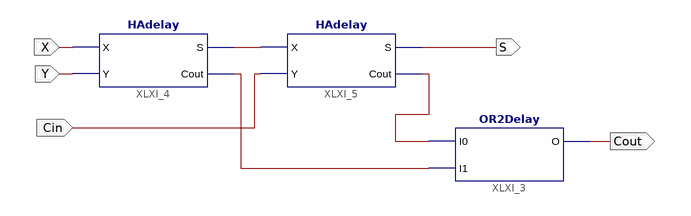
[diagram p0: schematic sheet 1]
// Xilinx ISE schematic FAdelay.sch (spartan6) as structural Verilog: 3 symbols, 5 ports
module FAdelay (
  input  Cin,
  input  X,
  input  Y,
  output S,
  output Cout
);

  wire XLXN_1, XLXN_3, XLXN_4;

  OR2Delay XLXI_3 (.I0(XLXN_4), .I1(XLXN_3), .O(Cout));
  HAdelay XLXI_4 (.X(X), .Y(Y), .S(XLXN_1), .Cout(XLXN_3));
  HAdelay XLXI_5 (.X(XLXN_1), .Y(Cin), .S(S), .Cout(XLXN_4));
endmodule
